# EAGLE design Varaible power supply (EAGLE 8.6.3)
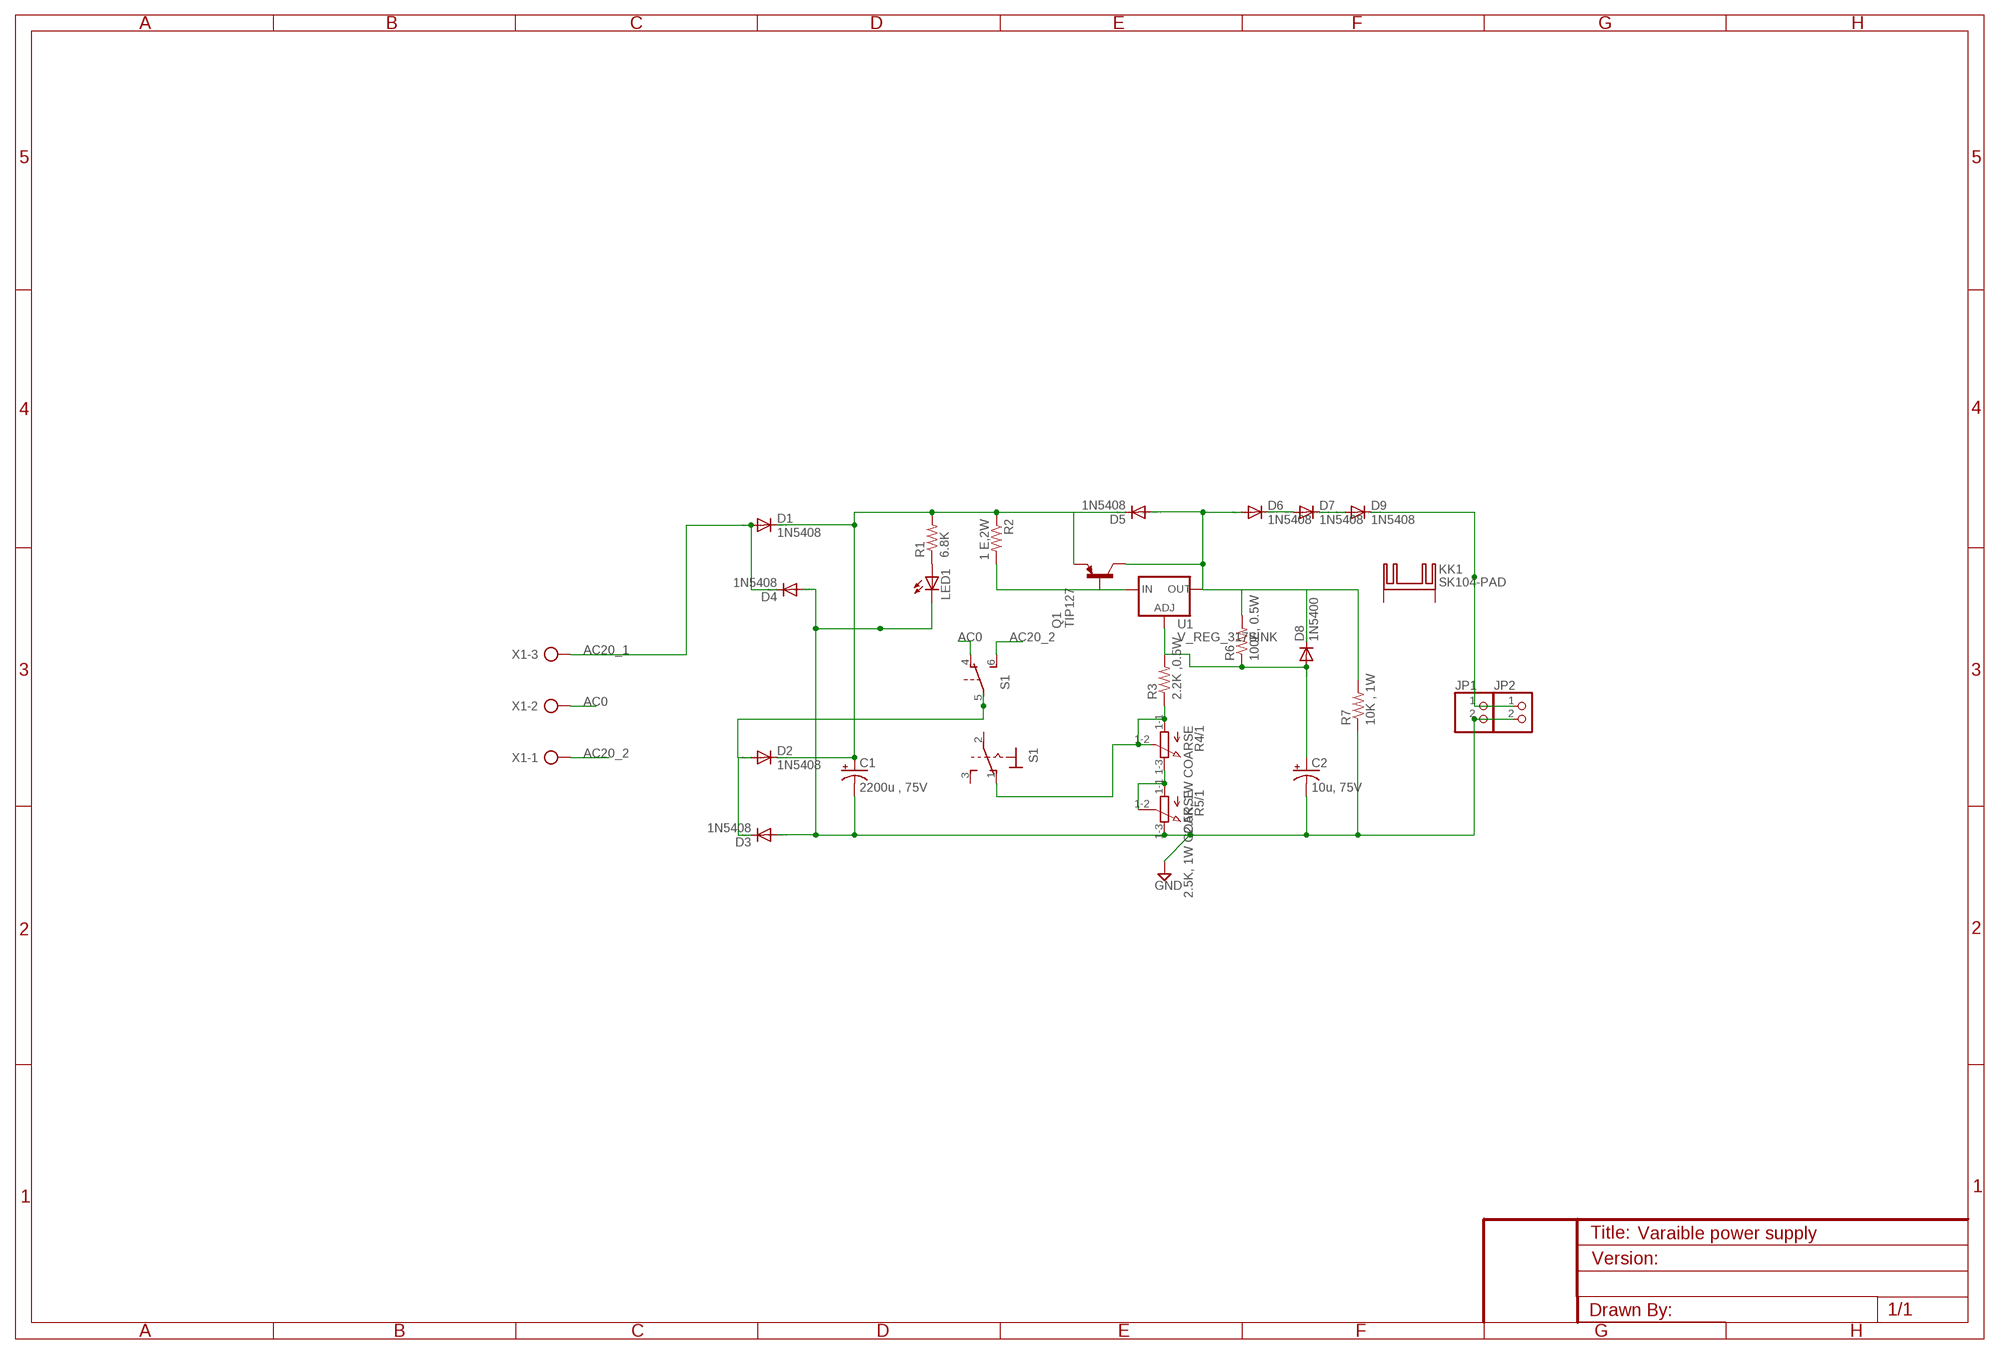
[diagram p0: schematic, sheet 1]

## Parts
C1  2200u , 75V  CPOL-USE5-13  [E5-13]
C2  10u, 75V  CPOL-USE5-13  [E5-13]
D1  1N5408  1N5400  [DO201-15]
D2  1N5408  1N5400  [DO201-15]
D3  1N5408  1N5400  [DO201-15]
D4  1N5408  1N5400  [DO201-15]
D5  1N5408  1N5400  [DO201-15]
D6  1N5408  1N5400  [DO201-15]
D7  1N5408  1N5400  [DO201-15]
D8  1N5400  [DO201-15]
D9  1N5408  1N5400  [DO201-15]
JP1  PINHD-1X2  [1X02]
JP2  PINHD-1X2  [1X02]
KK1  SK104-PAD  [SK104-PAD]
LED1  LED5MM  [LED5MM]
Q1  TIP127  TIP30  [TO220]
R1  6.8K  R-US_0411/15  [0411/15]
R2  1 E,2W  R-US_0411/15  [0411/15]
R3  2.2K ,0.5W  R-US_0411/15  [0411/15]
R4  2.5K, 1W COARSE  3RP/1610G  [3RP/1610G]
R5  2.5K, 1W COARSE  3RP/1610G  [3RP/1610G]
R6  100E, 0.5W  R-US_0411/15  [0411/15]
R7  10K , 1W  R-US_0411/15  [0411/15]
S1  320-938  [320-938]
U1  V_REG_317SINK  [TO220-ADJ]
X1  AK500/3-H  [AK500/3-H]

## Nets
AC0: S1.4(B:O) X1.2
AC20_1: D1.A D4.C X1.3
AC20_2: S1.6(B:S) X1.1
GND: C1.- C2.- D3.A D4.A JP1.2 JP2.2 LED1.K(C) R5.1-3(/1:E) R7.1
N$1: D6.C D7.A
N$2: D7.C D9.A
N$3: C1.+ D1.C D2.C D5.C Q1.3(E) R1.2 R2.1
N$4: LED1.A R1.1
N$5: Q1.1(B) R2.2 U1.IN
N$6: D5.A D6.A D8.C Q1.2(C) R6.2 R7.2 U1.OUT
N$7: C2.+ D8.A R3.2 R6.1 U1.ADJ
N$8: R3.1 R4.1-1(/1:A) R4.1-2(/1:S) S1.1(1:O)
N$9: R4.1-3(/1:E) R5.1-1(/1:A) R5.1-2(/1:S)
N$10: D9.C JP1.1 JP2.1
N$12: D2.A D3.C S1.5(B:P)
Unconnected: KK1.K1(K) KK1.K2(K) R4.2-1(/2:A) R4.2-2(/2:S) R4.2-3(/2:E) R5.2-1(/2:A) R5.2-2(/2:S) R5.2-3(/2:E) S1.2(1:P) S1.3(1:S)

## Library data of the parts
C1 C2 = rcl:CPOL-US: POLARIZED CAPACITOR, American symbol
D1-D9 = diode:1N5400: DIODE standard rectifier, 3 A, 50 V (Motorola)
JP1 JP2 = pinhead:PINHD-1X2: PIN HEADER
KK1 = heatsink:SK104-PAD: HEATSINK manufacturer Fischer/distributor Buerklin
LED1 = adafruit:LED: LED OSRAM: - CHIPLED LG R971, LG N971, LY N971, LG Q971, LY Q971, LO R971, LY R971 LH N974, LH R974 LS Q976, LO Q976, LY Q976 LO Q996 - Hyper CHIPLED LW Q18S LB Q993, LB Q99A, LB R99A - SideLED LS A670, LO A670, LY A670, LG A670, LP A670 LB A673, LV A673, LT A673, LW A673 LH A674 LY A675 LS A676, LA A676, LO A676, LY A676, LW A676 LS A679, LY A679, LG A679 - Hyper Micro SIDELED® LS Y876, LA Y876, LO Y876, LY Y876 LT Y87S - SmartLED LW L88C, LW L88S LB L89C, LB L89S, LG L890 LS L89K, LO L89K, LY L89K LS L896, LA L896, LO L896, LY L896 - TOPLED LS T670, LO T670, LY T670, LG T670, LP T670 LSG T670, LSP T670, LSY T670, LOP T670, LYG T670 LG T671, LOG T671, LSG T671 LB T673, LV T673, LT T673, LW T673 LH T674 LS T676, LA T676, LO T676, LY T676, LB T676, LH T676, LSB T676, LW T676 LB T67C, LV T67C, LT T67C, LS T67K, LO T67K, LY T67K, LW E67C LS E67B, LA E67B, LO E67B, LY E67B, LB E67C, LV E67C, LT E67C LW T67C LS T679, LY T679, LG T679 LS T770, LO T770, LY T770, LG T770, LP T770 LB T773, LV T773, LT T773, LW T773 LH T774 LS E675, LA E675, LY E675, LS T675 LS T776, LA T776, LO T776, LY T776, LB T776 LHGB T686 LT T68C, LB T68C - Hyper Mini TOPLED® LB M676 - Mini TOPLED Santana® LG M470 LS M47K, LO M47K, LY M47K Source: http://www.osram.convergy.de/
Q1 = transistor-pnp:TIP30: PNP Transistor
R1-R3 R6 R7 = rcl:R-US_: RESISTOR, American symbol
R4 R5 = pot:3RP/1610G: 16mm Potentiometer two level Source: http://www.alphapotentiometers.net/html/16mm_pot_2.html
S1 = switch:320-938: TOGGLE SWITCH distributor RS Components
U1 = SparkFun-IC-Power:V_REG_317: Voltage Regulator Standard LM317 adjustable voltage regulator. AOI (Adjust Output Input). Google 'LM317 Calculator' for easy to use app to get the two resistor values needed. 240/720 for 5V output. 240/390 for 3.3V output. Spark Fun Electronics SKU : COM-00527
X1 = con-ptr500:AK500/3-H: CONNECTOR Aug. 2004 / PTR Meßtechnik: Die Bezeichnung der Serie AK505 wurde geändert. Es handelt sich hierbei um AK500 in horizontaler Ausführung.; OC_FARNELL: unknown; OC_NEWARK: unknown

## Board
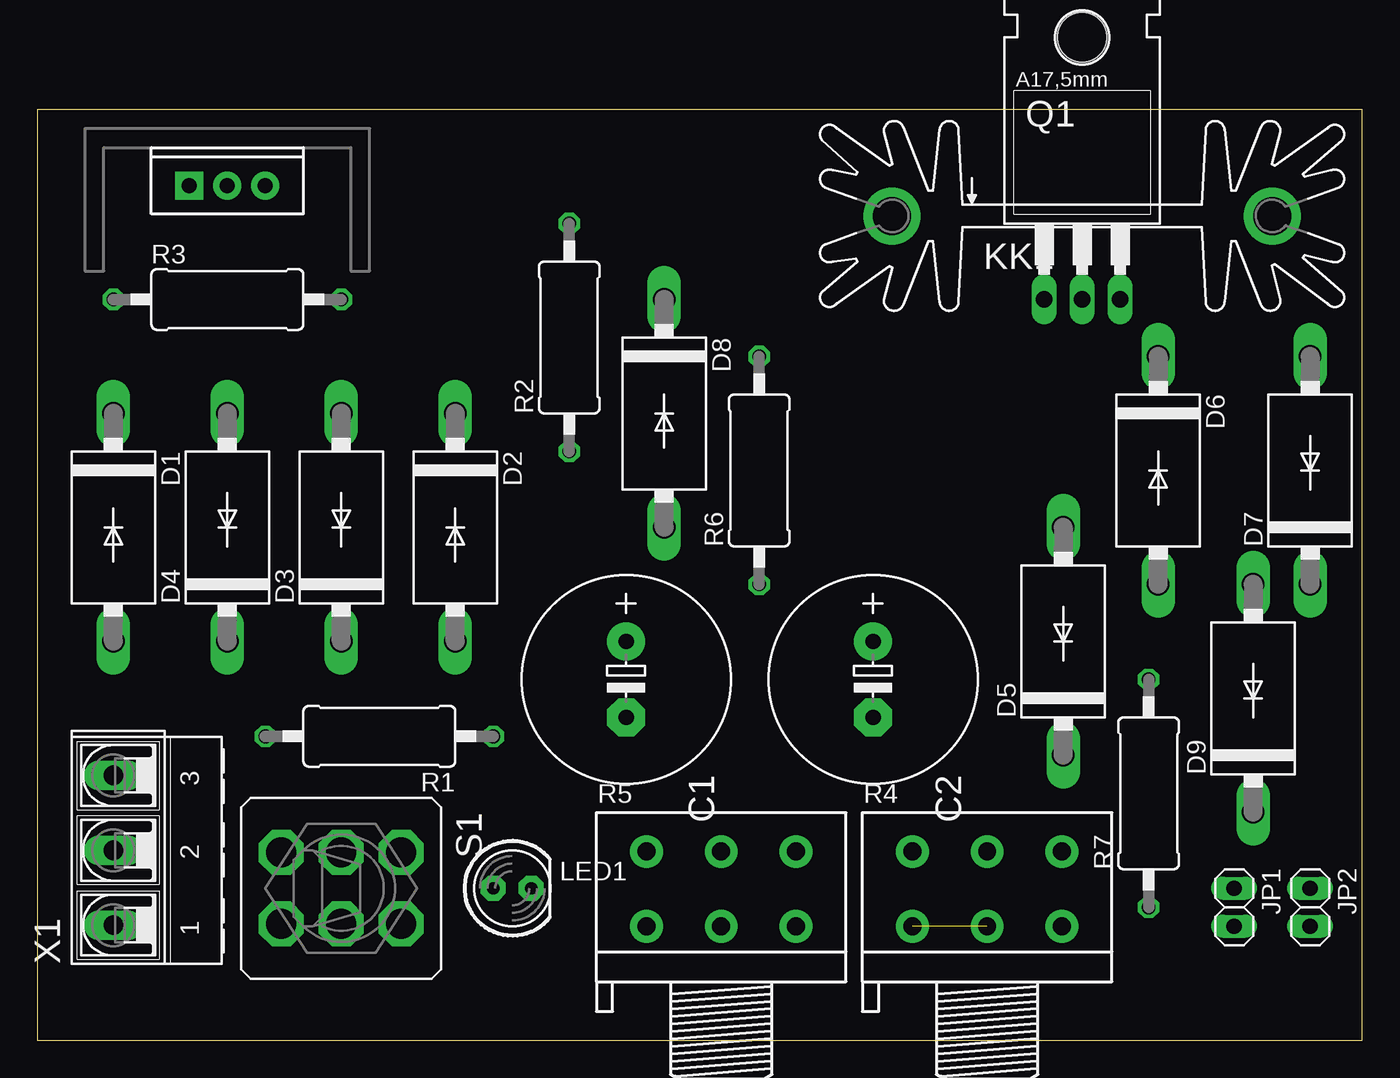
[diagram p1: board, top side]
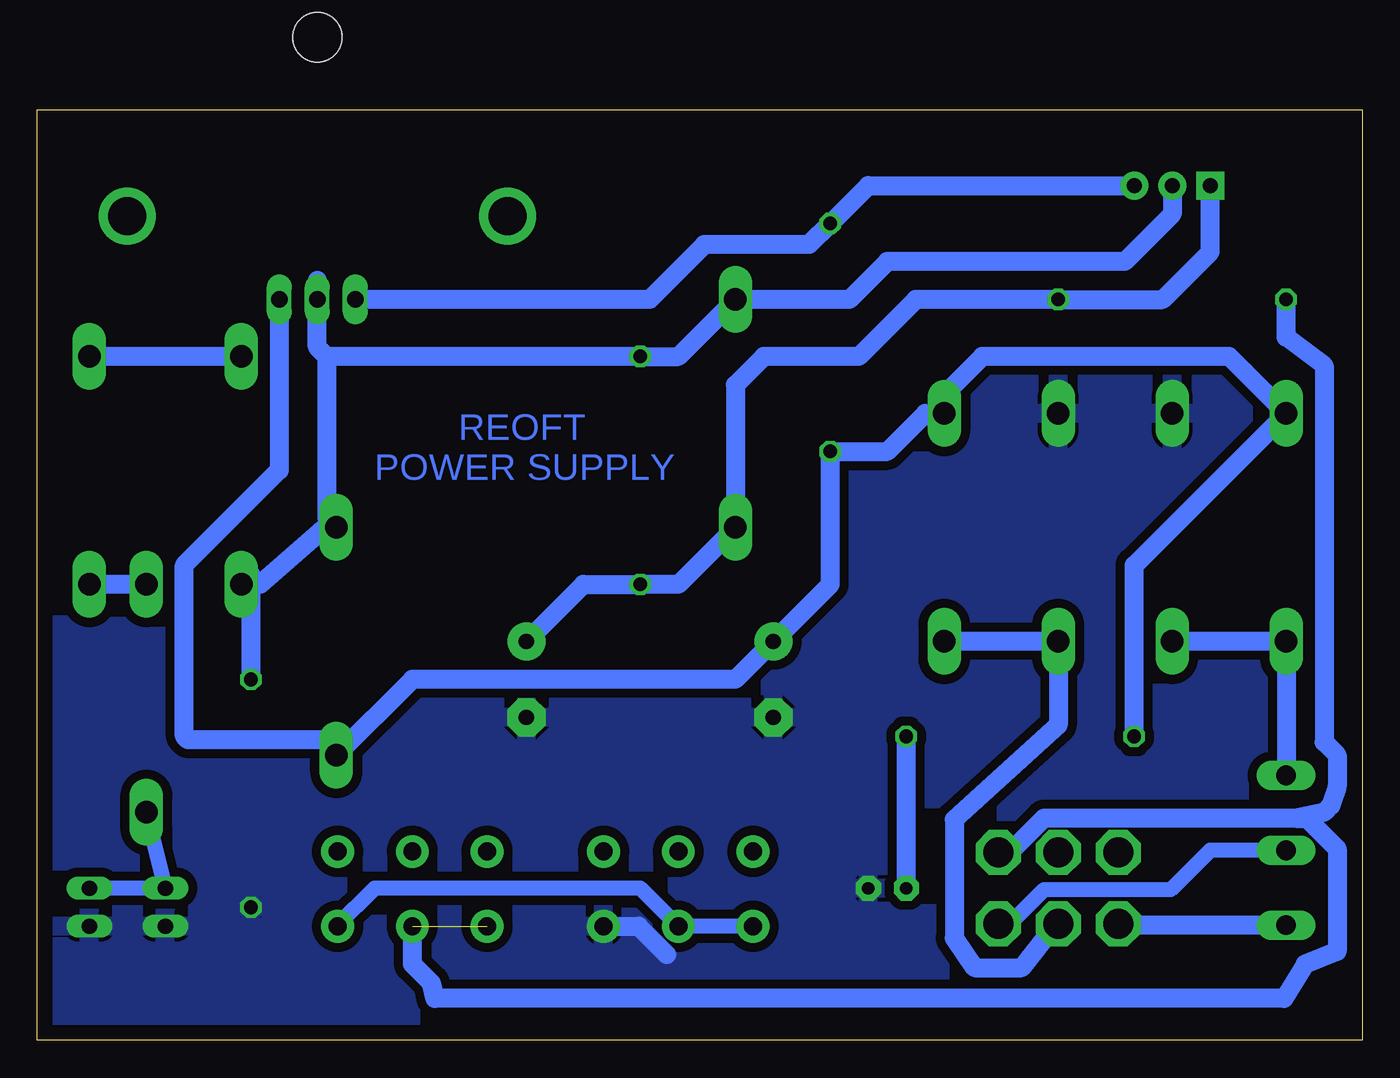
[diagram p2: board, bottom side, seen from below]

Size 88.57 x 62.22 mm. Coordinates in mm from the lower left corner, seen from the top.
Outline: 0,0 88.57,0 88.57,62.22 0,62.22 0,0
Copper layers (1*16): Top 0.035mm / dielectric 1.5mm / Bottom 0.035mm
Design rules "default": minimum track width 6mil, minimum drill 0.35mm, track to track 6mil, track to pad 6mil, pad to pad 6mil, via to via 6mil, smd to smd 6mil, copper to edge 40mil, drill to drill 6mil, minimum pad ring 10mil, minimum via ring 8mil, stop-mask expansion 4mil, vias tented up to drill 0mil, thermal gap 10mil

### Footprints (pad centres in the part's own frame; a part is rotated, then mirrored left to right if it is on the bottom)
E5-13 = drill 1.016 pad 2.54: + -2.54,0 | drill 1.016 pad 2.54 octagon: - 2.54,0
DO201-15 = drill 1.499 long: A 7.62,0; C -7.62,0
1X02 = drill 1.016 long: 1 -1.27,0; 2 1.27,0
SK104-PAD = drill 2.54 pad 3.81: K1 -12.7,-0.762; K2 12.7,-0.762
LED5MM = drill 0.813 pad 1.676 octagon: A -1.27,0; K 1.27,0
TO220 = drill 1.118 long: 1 -2.54,-6.35; 2 0,-6.35; 3 2.54,-6.35 | hole 3.302: 0,11.176
0411/15 = drill 0.914 octagon: 1 -7.62,0; 2 7.62,0
3RP/1610G = drill 1.2 pad 2.184: 1-1 -5,0; 1-2 0,0; 1-3 5,0; 2-1 -5,5; 2-2 0,5; 2-3 5,5
320-938 = drill 2.007 octagon: 1 -2.388,4.013; 2 -2.388,0; 3 -2.388,-4.013; 4 2.388,4.013; 5 2.388,0; 6 2.388,-4.013
TO220-ADJ = drill 1 pad 1.88 square: ADJ -2.54,0 | drill 1 pad 1.88: IN 2.54,0; OUT 0,0
AK500/3-H = drill 1.321 long: 1 -5.004,0; 2 0,0; 3 5.004,0

### Placement (x,y rotation side)
C1  39.37,24.13 270 top
C2  55.88,24.13 270 top
D1  5.08,34.29 270 top
D2  27.94,34.29 270 top
D3  20.32,34.29 90 top
D4  12.7,34.29 90 top
D5  68.58,26.67 90 top
D6  74.93,38.1 270 top
D7  85.09,38.1 90 top
D8  41.91,41.91 270 top
D9  81.28,22.86 90 top
JP1  80.01,8.89 270 top
JP2  85.09,8.89 270 top
KK1  69.85,55.88 0 top
LED1  31.75,10.16 0 top
Q1  69.85,55.88 0 top
R1  22.86,20.32 180 top
R2  35.56,46.99 90 top
R3  12.7,49.53 0 top
R4  63.5,7.62 0 top
R5  45.72,7.62 0 top
R6  48.26,38.1 90 top
R7  74.3,16.51 90 top
S1  20.32,10.16 270 top
U1  12.7,57.15 0 top
X1  5.08,12.7 90 top

### Tracks (layer width: path | path; a pad name or v marks a point on that pad's centre or on a via)
AC0
  Bottom 1.016: X1.2 10.16,12.7 12.79,10.07 21.27,10.07 23.56,7.77 S1.4
AC20_1
  Bottom 1.27: D4.C D1.A X1.3
AC20_2
  Bottom 1.27: X1.1 16.23,7.7 S1.6
GND
  Bottom 1.27: R5.1-3 48.38,7.62 46.5,5.74
  pour Bottom (isolate 0.61): 1.27,1.27 87.63,1.27 87.63,60.96 1.27,60.96
N$1
  Bottom 1.27: D6.C D7.A
N$2
  Bottom 1.27: D9.A D7.C
N$3
  Bottom 1.016: D5.C 69.62,20.09
  Bottom 1.27: D5.C 63.5,24.13 41.91,24.13 C1.+ 35.56,30.48 R2.1 31.75,39.37 29.21,41.91 D2.C 27.94,43.18 25.4,45.72 8.89,45.72 D1.C 15.24,31.75 R1.2 | Q1.3 72.39,38.12 78.74,31.77 78.74,20.32 78.51,20.09 | 72.62,20.09 78.51,20.09 | 69.62,20.09 78.51,20.09
N$4
  Bottom 1.27: LED1.A R1.1
N$5
  Bottom 1.27: Q1.1 47.64,49.53 43.97,53.2 36.97,53.2 R2.2 33.02,57.15 U1.IN
N$6
  Bottom 1.27: U1.OUT 12.7,55.25 15.88,52.07 31.75,52.07 34.29,49.53 D8.C 45.72,45.72 R6.2 69.22,45.72 | 74.3,29.84 74.93,29.21 D6.A 73.66,30.48 68.58,34.92 D5.A 69.22,34.92 69.22,45.72 | 74.3,29.84 74.3,31.12 | 74.3,29.84 R7.2 | 69.22,45.72 69.85,46.36 Q1.2 69.85,50.8
N$7
  Bottom 1.27: U1.ADJ 10.16,52.7 13.34,49.53 R3.2 29.84,49.53 33.66,45.72 40.01,45.72 41.91,43.81 D8.A 45.72,30.48 R6.1 52.07,30.48 C2.+
N$8  (1 unrouted)
  Bottom 1.27: R3.1 5.08,47.01 2.53,45.1 2.53,19.93 1.68,19.08 1.68,16.97 2.08,15.7 2.54,15.24 4.44,14.84 | 4.44,14.84 21.27,14.84 23.41,12.7 25.2,12.7 25.05,12.55 S1.1 | 4.44,14.84 3.71,14.84 1.68,12.8 1.68,5.94 3.81,5.08 5.21,2.79 61.98,2.79 62.23,3.81 63.5,5.08 R4.1-2
N$9
  Bottom 1.016: R5.1-1 R5.1-2 48.26,10.16 66.04,10.16 68.58,7.62
  Bottom 1.27: 68.58,7.62 R4.1-3
N$10
  Bottom 1.016: D9.C JP1.1 JP2.1
N$12
  Bottom 1.27: D2.A D3.C 20.32,21.07 27.26,14.77 27.26,6.82 25.92,4.85 22.75,4.85 20.46,7.77 S1.5

### Text on the board
Bottom: REOFT / POWER SUPPLY